# Altium schematic sheet AFR_Template_Main.SchDoc
size A4; Author: Auth. Name; CompanyName: Audi Formula Racing GmbH; Organization: Audi Formula Racing GmbH; Address1: Heinrichsheimstr. 200; Address2: D-86633 Neuburg a.d. Donau; SheetNumber: 1; SheetTotal: 6
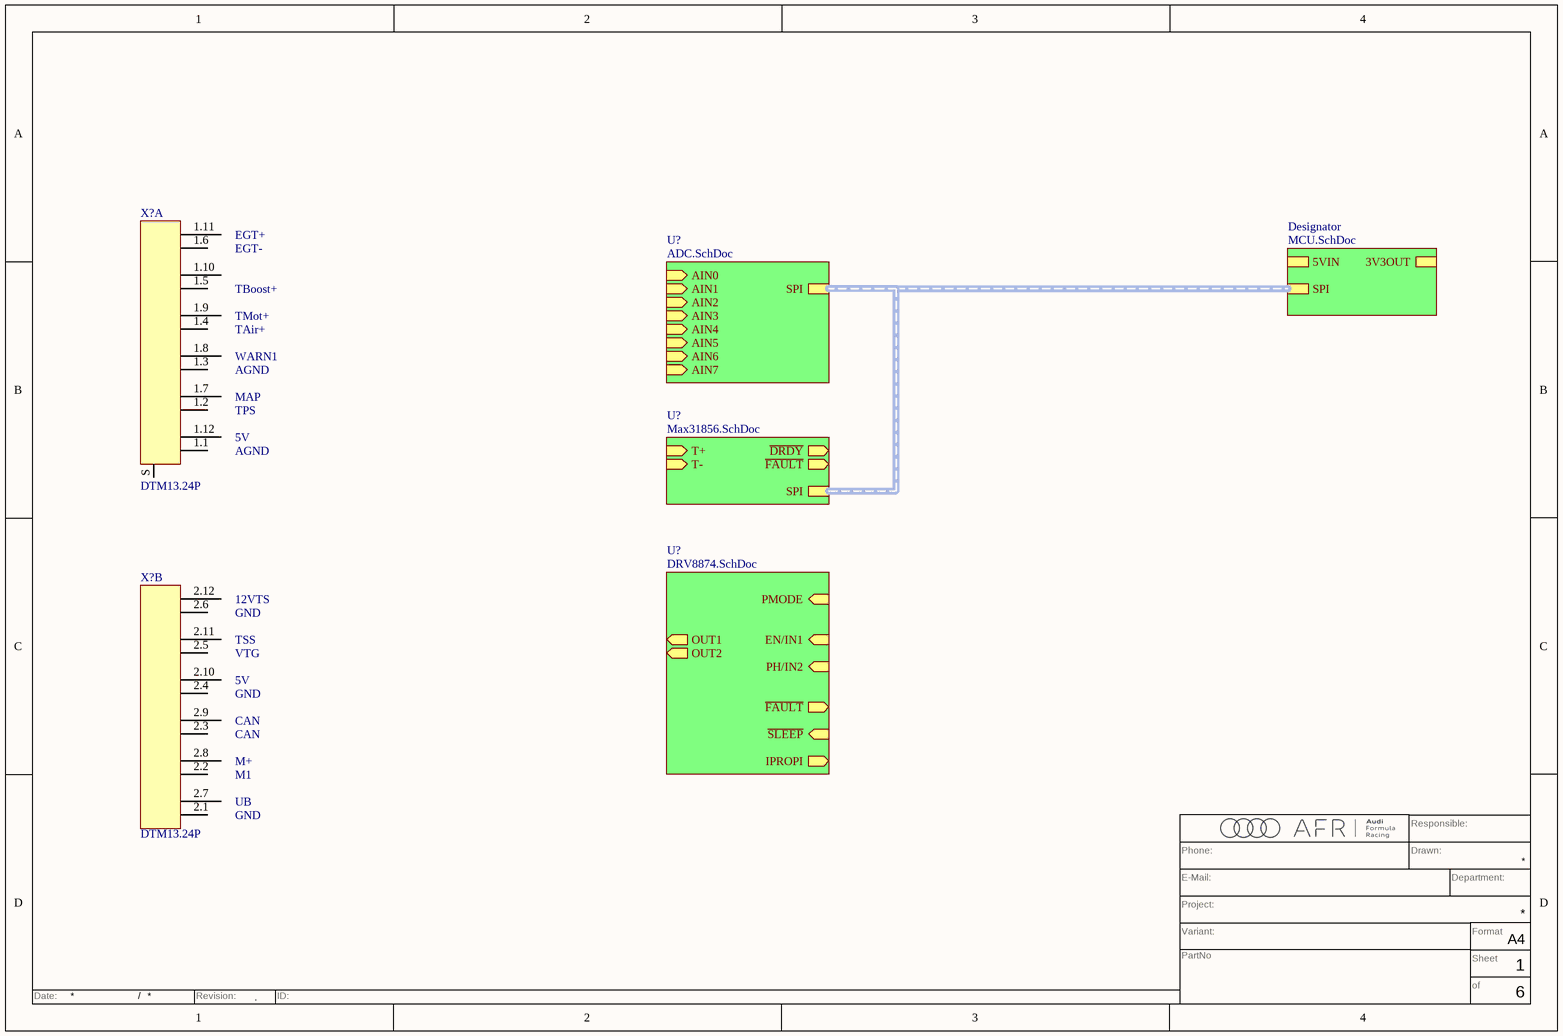
[diagram p0: AFR_Template_Main.SchDoc]

## Parts
(Parts that share a designator on the sheet are numbered #1, #2 ... from top to bottom, then left to right.)
X?#1  DTM13.24P  [DTM13-24P]  (part A of 2)
X?#2  DTM13.24P  [DTM13-24P]  (part B of 2)

## Sub-sheets
Designator = MCU.SchDoc: 5VIN, 3V3OUT, SPI (harness SPI)
U? = Max31856.SchDoc: T- (in), T+ (in), ~{DRDY} (out), ~{FAULT} (out), SPI (harness SPI)
U? = DRV8874.SchDoc: OUT1 (out), OUT2 (out), ~{FAULT} (out), ~{SLEEP} (in), EN/IN1 (in), IPROPI (out), PH/IN2 (in), PMODE (in)
U? = ADC.SchDoc: AIN0 (in), AIN1 (in), AIN2 (in), AIN3 (in), AIN4 (in), AIN5 (in), AIN6 (in), AIN7 (in), SPI (harness SPI)

## Nets

Not connected (* = marked no-connect by the designer): X?#1 1.1 1.2 1.3 1.4 1.5 1.6 1.7 1.8 1.9 1.10 1.11 1.12 S; X?#2 2.1 2.2 2.3 2.4 2.5 2.6 2.7 2.8 2.9 2.10 2.11 2.12

## Buses and harness runs
harness sheet Designator/SPI = sheet U?/SPI

## Notes on the sheet
- EGT+
- EGT-
- TMot+
- TBoost+
- TAir+
- WARN1
- AGND
- 5V
- TPS
- MAP
- TSS
- VTG
- 12VTS
- GND
- CAN
- M+
- M1
- UB
- Phone:
- Responsible:
- Drawn:
- Variant:
- Project:
- E-Mail:
- Department:
- Format
- PartNo
- of
- Sheet
- A4
- Date:
- /
- Revision:
- .
- ID:

## Library data of the parts
X?#1 X?#2 = CMP-005-000001-3: Source: Deutsch.SchLib; Design Item ID: DTM13.24P; Pin Count: 25; Component Type: Standard